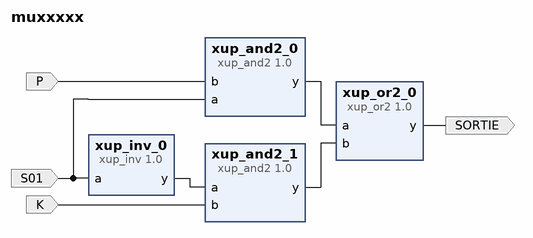
[diagram p0: block diagram of the top level]
# Vivado block design muxxxxx, xc7a100tcsg324-1, Vivado 2018.3
create_bd_design muxxxxx

create_bd_port -dir I K
create_bd_port -dir I P
create_bd_port -dir I S01
create_bd_port -dir O SORTIE

create_bd_cell -type ip -vlnv xilinx.com:xup:xup_inv:1.0 xup_inv_0
create_bd_cell -type ip -vlnv xilinx.com:xup:xup_and2:1.0 xup_and2_0
create_bd_cell -type ip -vlnv xilinx.com:xup:xup_and2:1.0 xup_and2_1
create_bd_cell -type ip -vlnv xilinx.com:xup:xup_or2:1.0 xup_or2_0

# ---- connections ----

connect_bd_net [get_bd_ports K] [get_bd_pins xup_and2_1/b]
connect_bd_net [get_bd_pins xup_inv_0/y] [get_bd_pins xup_and2_1/a]
connect_bd_net -net S01_1 [get_bd_ports S01] [get_bd_pins xup_inv_0/a] [get_bd_pins xup_and2_0/a]
connect_bd_net [get_bd_ports P] [get_bd_pins xup_and2_0/b]
connect_bd_net [get_bd_pins xup_and2_1/y] [get_bd_pins xup_or2_0/b]
connect_bd_net [get_bd_pins xup_and2_0/y] [get_bd_pins xup_or2_0/a]
connect_bd_net [get_bd_pins xup_or2_0/y] [get_bd_ports SORTIE]

validate_bd_design
save_bd_design
